# EasyEDA schematic SCH_1-Up-Hackpad_2025-02-28.json
TITLE: Sheet_1; REV: 1.0; Date: 2025-02-09; Sheet: 1/1; Drawn By: esemv; Company: Your Company
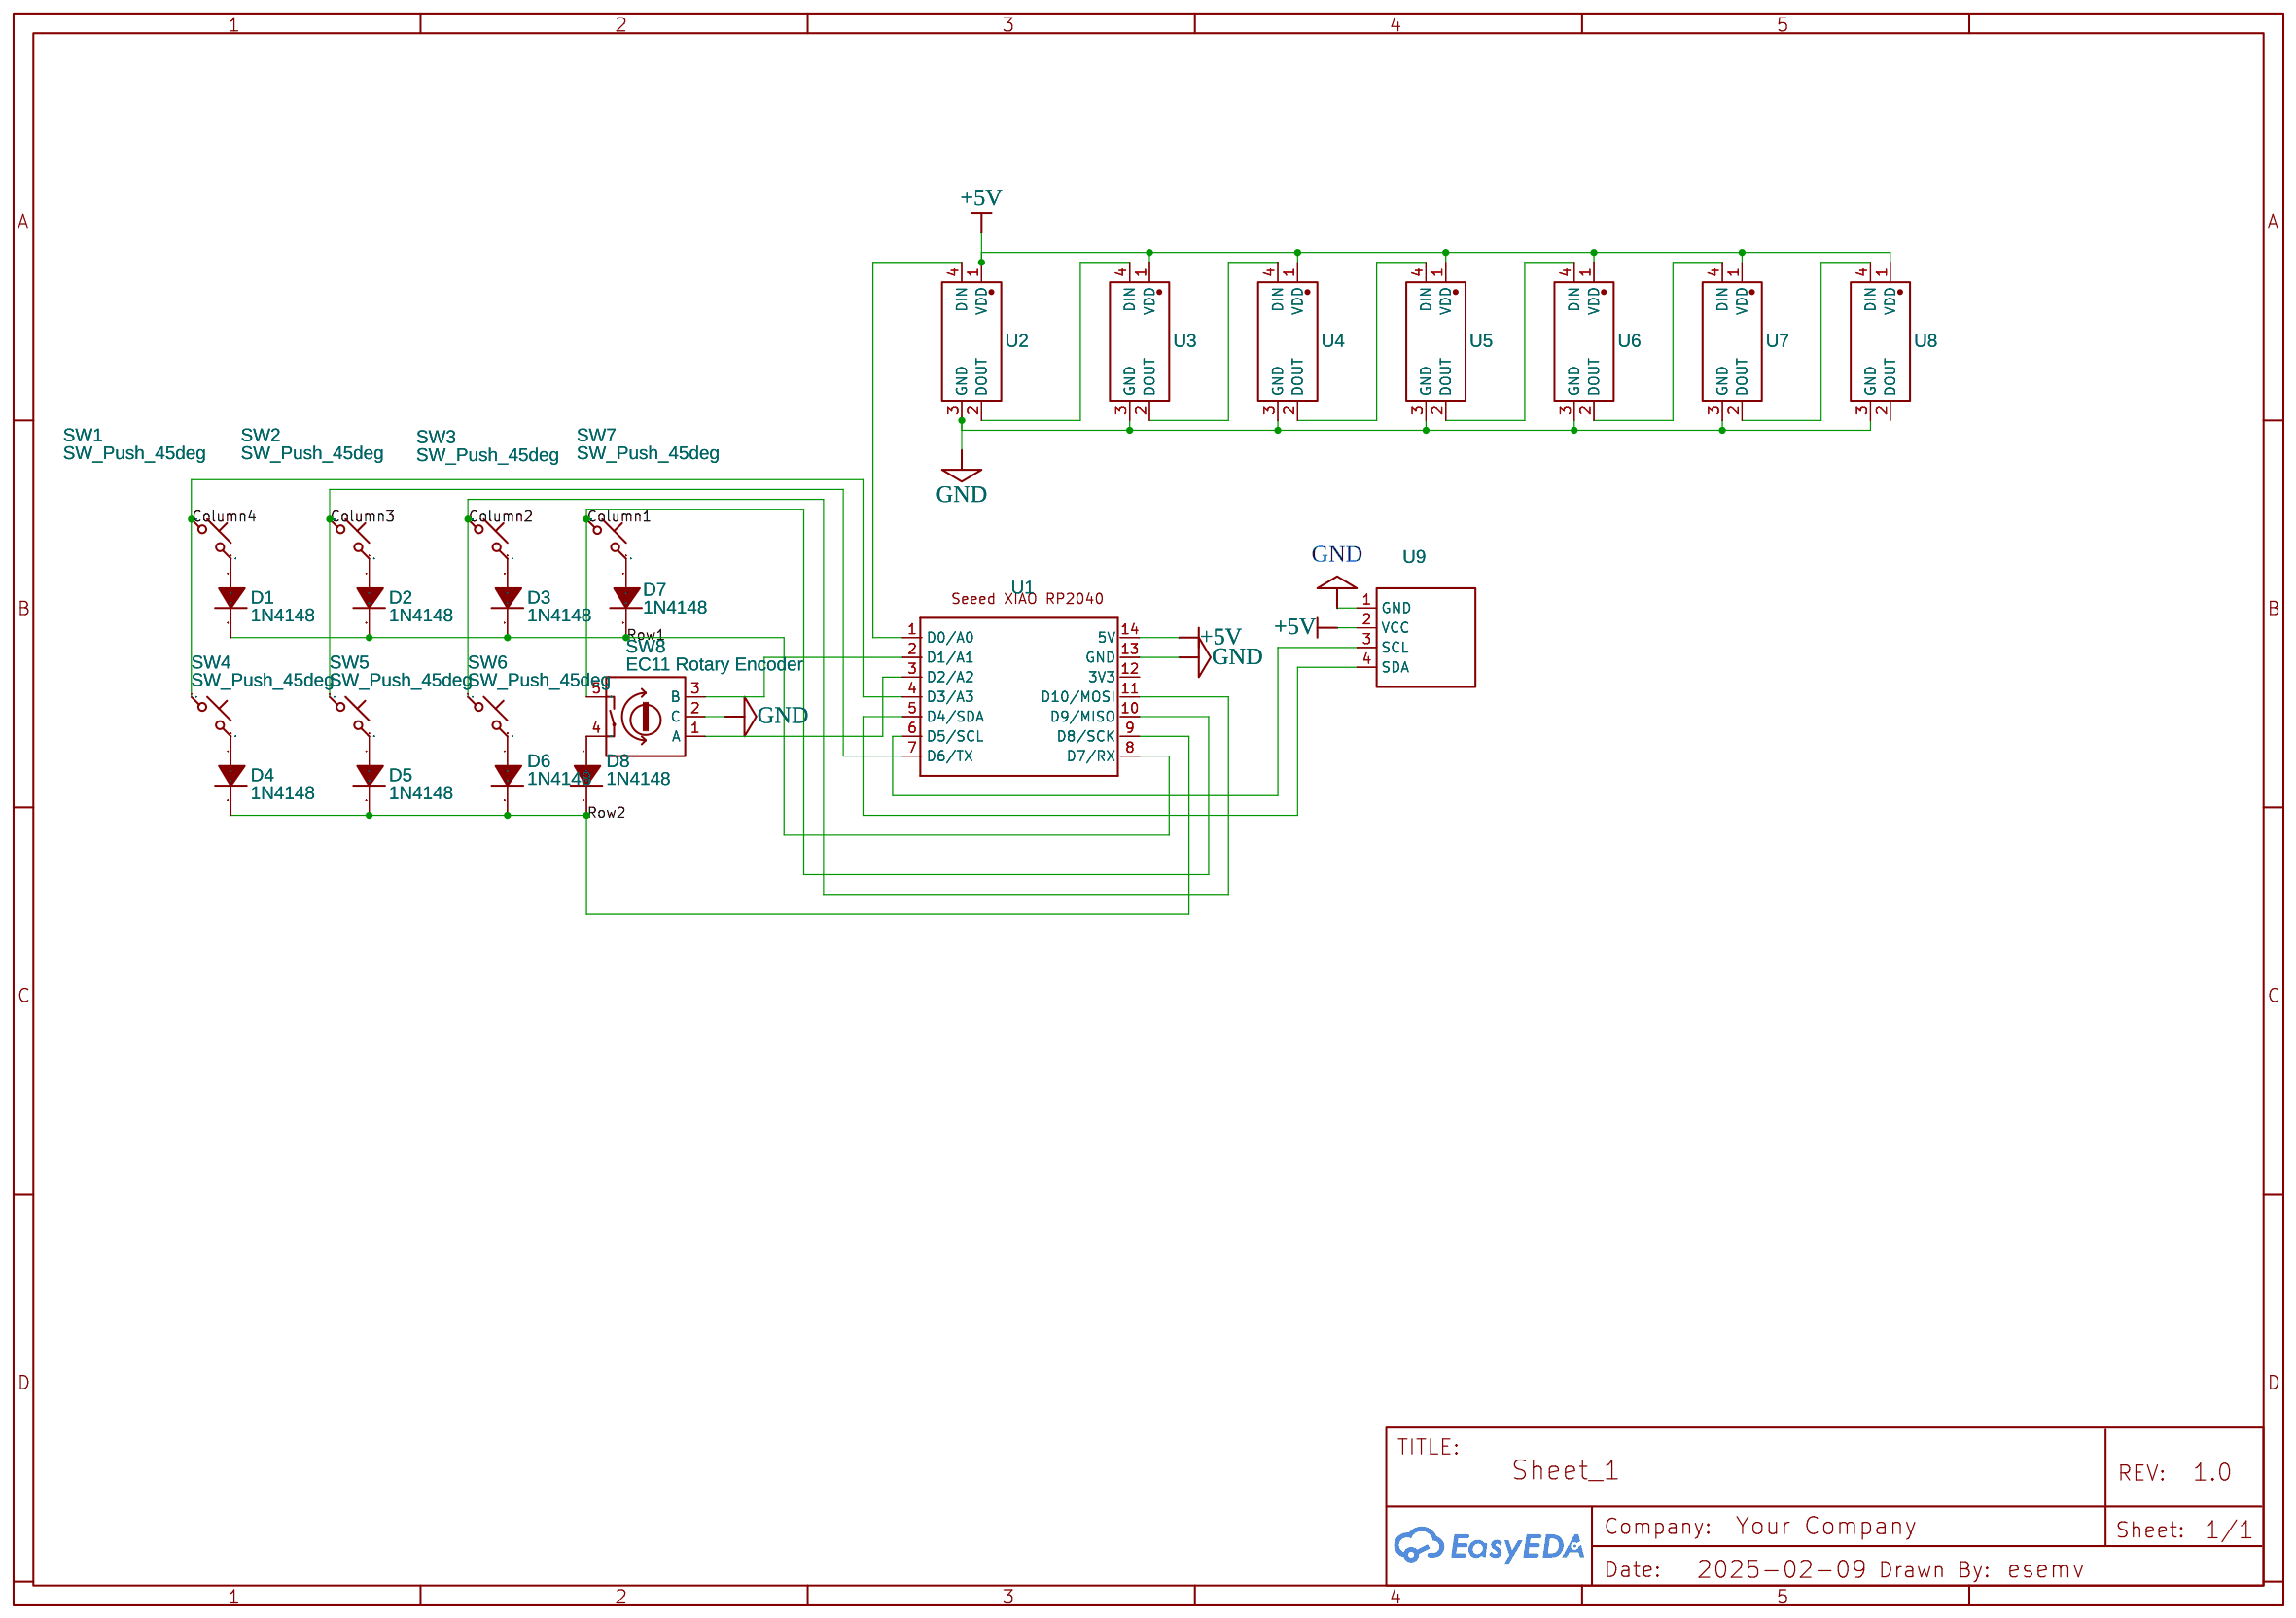
[diagram p0: schematic sheet]

## Parts
D1  1N4148  [DO-35_BD2.0-L4.0-P8.00-D0.5-FD]
D2  1N4148  [DO-35_BD2.0-L4.0-P8.00-D0.5-FD]
D3  1N4148  [DO-35_BD2.0-L4.0-P8.00-D0.5-FD]
D4  1N4148  [DO-35_BD2.0-L4.0-P8.00-D0.5-FD]
D5  1N4148  [DO-35_BD2.0-L4.0-P8.00-D0.5-FD]
D6  1N4148  [DO-35_BD2.0-L4.0-P8.00-D0.5-FD]
D7  1N4148  [DO-35_BD2.0-L4.0-P8.00-D0.5-FD]
D8  1N4148  [DO-35_BD2.0-L4.0-P8.00-D0.5-FD]
SW1  SW_Push_45deg  [SW_CHERRY_MX_PCB_1.00U]
SW2  SW_Push_45deg  [SW_CHERRY_MX_PCB_1.00U]
SW3  SW_Push_45deg  [SW_CHERRY_MX_PCB_1.00U]
SW4  SW_Push_45deg  [SW_CHERRY_MX_PCB_1.00U]
SW5  SW_Push_45deg  [SW_CHERRY_MX_PCB_1.00U]
SW6  SW_Push_45deg  [SW_CHERRY_MX_PCB_1.00U]
SW7  SW_Push_45deg  [SW_CHERRY_MX_PCB_1.00U]
SW8  EC11 Rotary Encoder  [EC11 ROTARY ENCODER]
U1  NO  [XIAO_RP2040_SEEED]
U2  NO  [SK6812MINI-E_REVERSE-MOUNT]
U3  NO  [SK6812MINI-E_REVERSE-MOUNT]
U4  NO  [SK6812MINI-E_REVERSE-MOUNT]
U5  NO  [SK6812MINI-E_REVERSE-MOUNT]
U6  NO  [SK6812MINI-E_REVERSE-MOUNT]
U7  NO  [SK6812MINI-E_REVERSE-MOUNT]
U8  NO  [SK6812MINI-E_REVERSE-MOUNT]
U9  NO  [SSD1306-0.91-OLED-4PIN-128X32]

## Library data of the parts
D1-D8 = 1N4148: Supplier: LCSC; Manufacturer: ST(先科); Supplier Part: C14516; JLCPCB Part Class: Extended Part; link: https://lcsc.com/eda_search?q=C14516&%26type=1&ref=editor
SW1-SW7 = SW_Push_45deg: Contributor: KiCAD; license: https://www.gnu.org/licenses/lgpl-2.1.html
SW8 = EC11 Rotary Encoder: Contributor: mhartrey
U1 = SEEED_XIAO_RP2040_HOLE: Contributor: eldar_rustamov
U2-U8 = NEOPIXEL_SK6812MINI-E: Supplier: LCSC; Supplier Part: C9900001298; Manufacturer: null; Manufacturer Part: SK6812MINI-E; JLCPCB Part Class: Extended Part; Contributor: lorymetall
U9 = JM SSD1306-128X32-OLED-0.91: sourceId: wICUcuL3l

## Nets
+5V: U1.14(5V) U2.1(VDD) U3.1(VDD) U4.1(VDD) U5.1(VDD) U6.1(VDD) U7.1(VDD) U8.1(VDD) U9.2(VCC)
GND: SW8.2(C) U1.13(GND) U2.3(GND) U3.3(GND) U4.3(GND) U5.3(GND) U6.3(GND) U7.3(GND) U8.3(GND) U9.1(GND)
Column1: SW7.1 SW8.5(Sw2) U1.10(D9/MISO)
Column2: SW3.1 SW6.1 U1.11(D10/MOSI)
Column3: SW2.1 SW5.1 U1.7(D6/TX)
Column4: SW1.1 SW4.1 U1.4(D3/A3)
Row1: D1.2(C) D2.2(C) D3.2(C) D7.2(C) U1.8(D7/RX)
Row2: D4.2(C) D5.2(C) D6.2(C) D8.2(C) U1.9(D8/SCK)
Net-(D1-1): D1.1(A) SW1.2
Net-(D2-1): D2.1(A) SW2.2
Net-(D3-1): D3.1(A) SW3.2
Net-(D4-1): D4.1(A) SW4.2
Net-(D5-1): D5.1(A) SW5.2
Net-(D6-1): D6.1(A) SW6.2
Net-(D7-1): D7.1(A) SW7.2
Net-(D8-1): D8.1(A) SW8.4(Sw1)
Net-(SW8-1): SW8.1(A) U1.3(D2/A2)
Net-(SW8-3): SW8.3(B) U1.2(D1/A1)
Net-(U1-1): U1.1(D0/A0) U2.4(DIN)
Net-(U1-5): U1.5(D4/SDA) U9.4(SDA)
Net-(U1-6): U1.6(D5/SCL) U9.3(SCL)
Net-(U2-2): U2.2(DOUT) U3.4(DIN)
Net-(U3-2): U3.2(DOUT) U4.4(DIN)
Net-(U4-2): U4.2(DOUT) U5.4(DIN)
Net-(U5-2): U5.2(DOUT) U6.4(DIN)
Net-(U6-2): U6.2(DOUT) U7.4(DIN)
Net-(U7-2): U7.2(DOUT) U8.4(DIN)

Not connected (* = marked no-connect by the designer): U1 12(3V3); U8 2(DOUT)
